# EAGLE board stm32-2inch40-usb-sd-proto (EAGLE 6.6.0), part 1 of 2
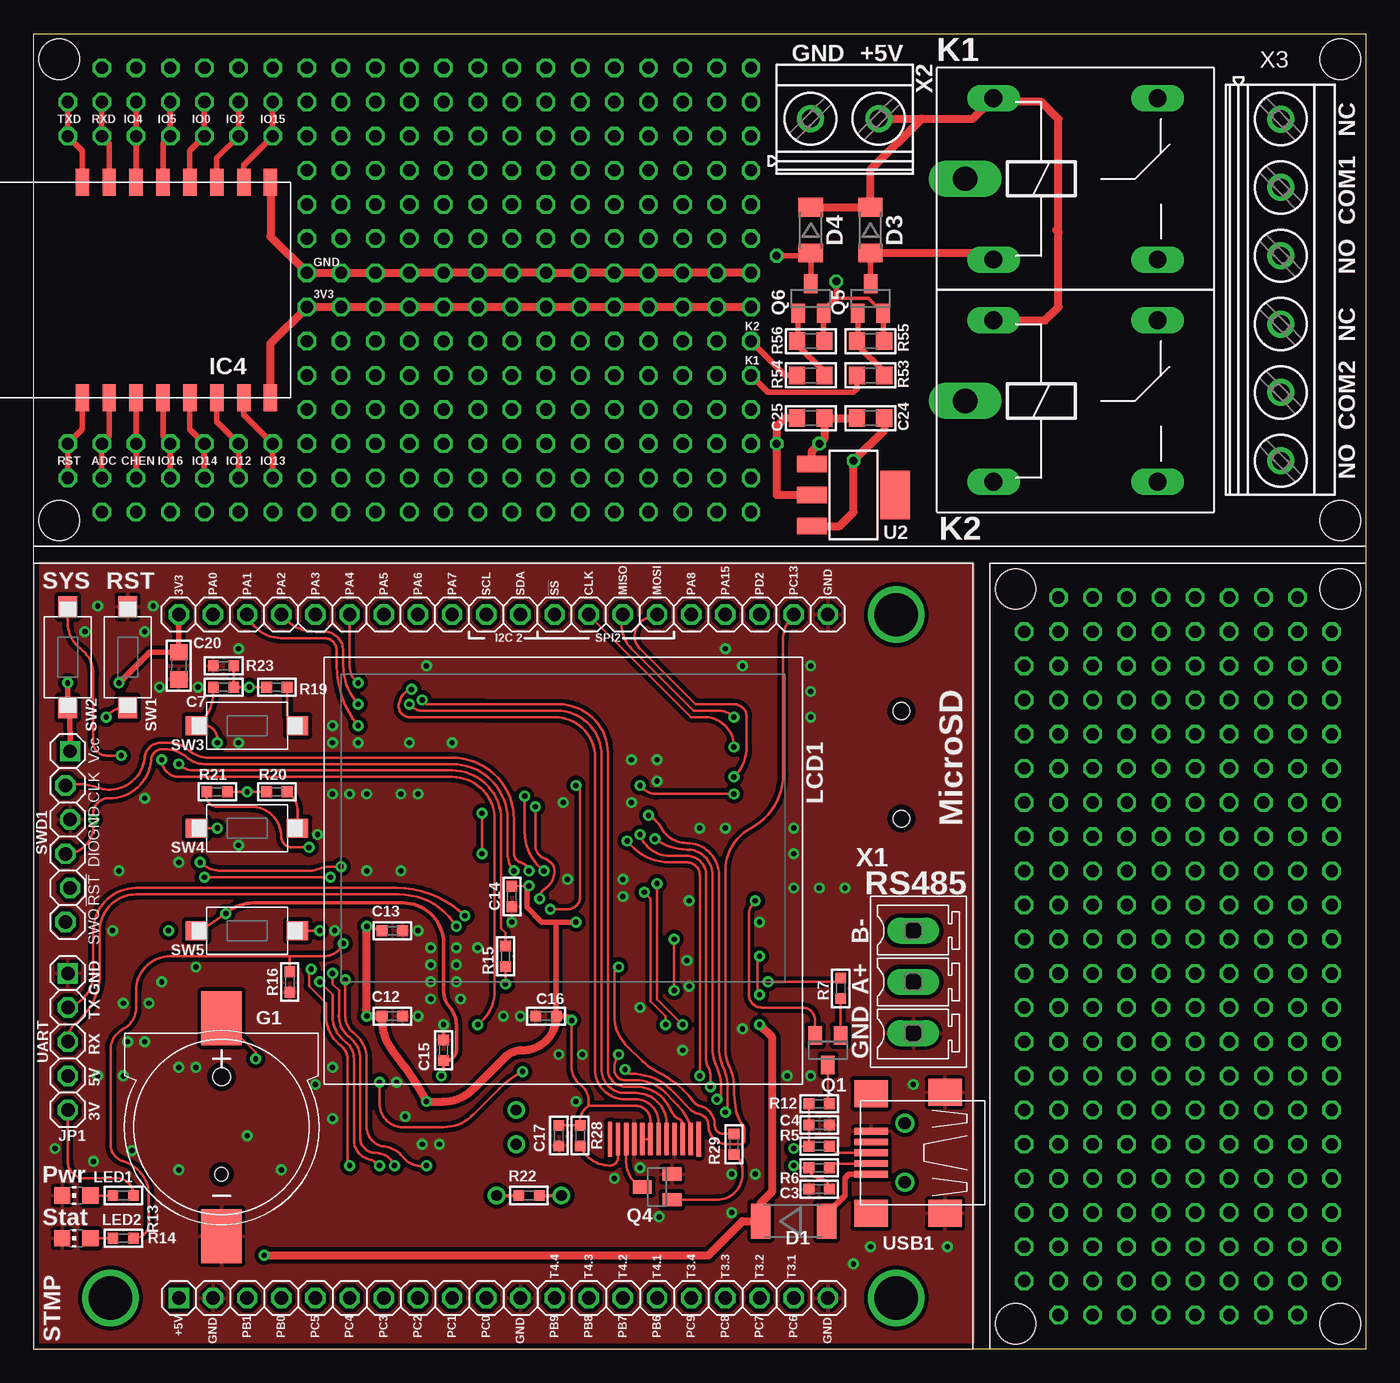
[diagram p3: board, top side]
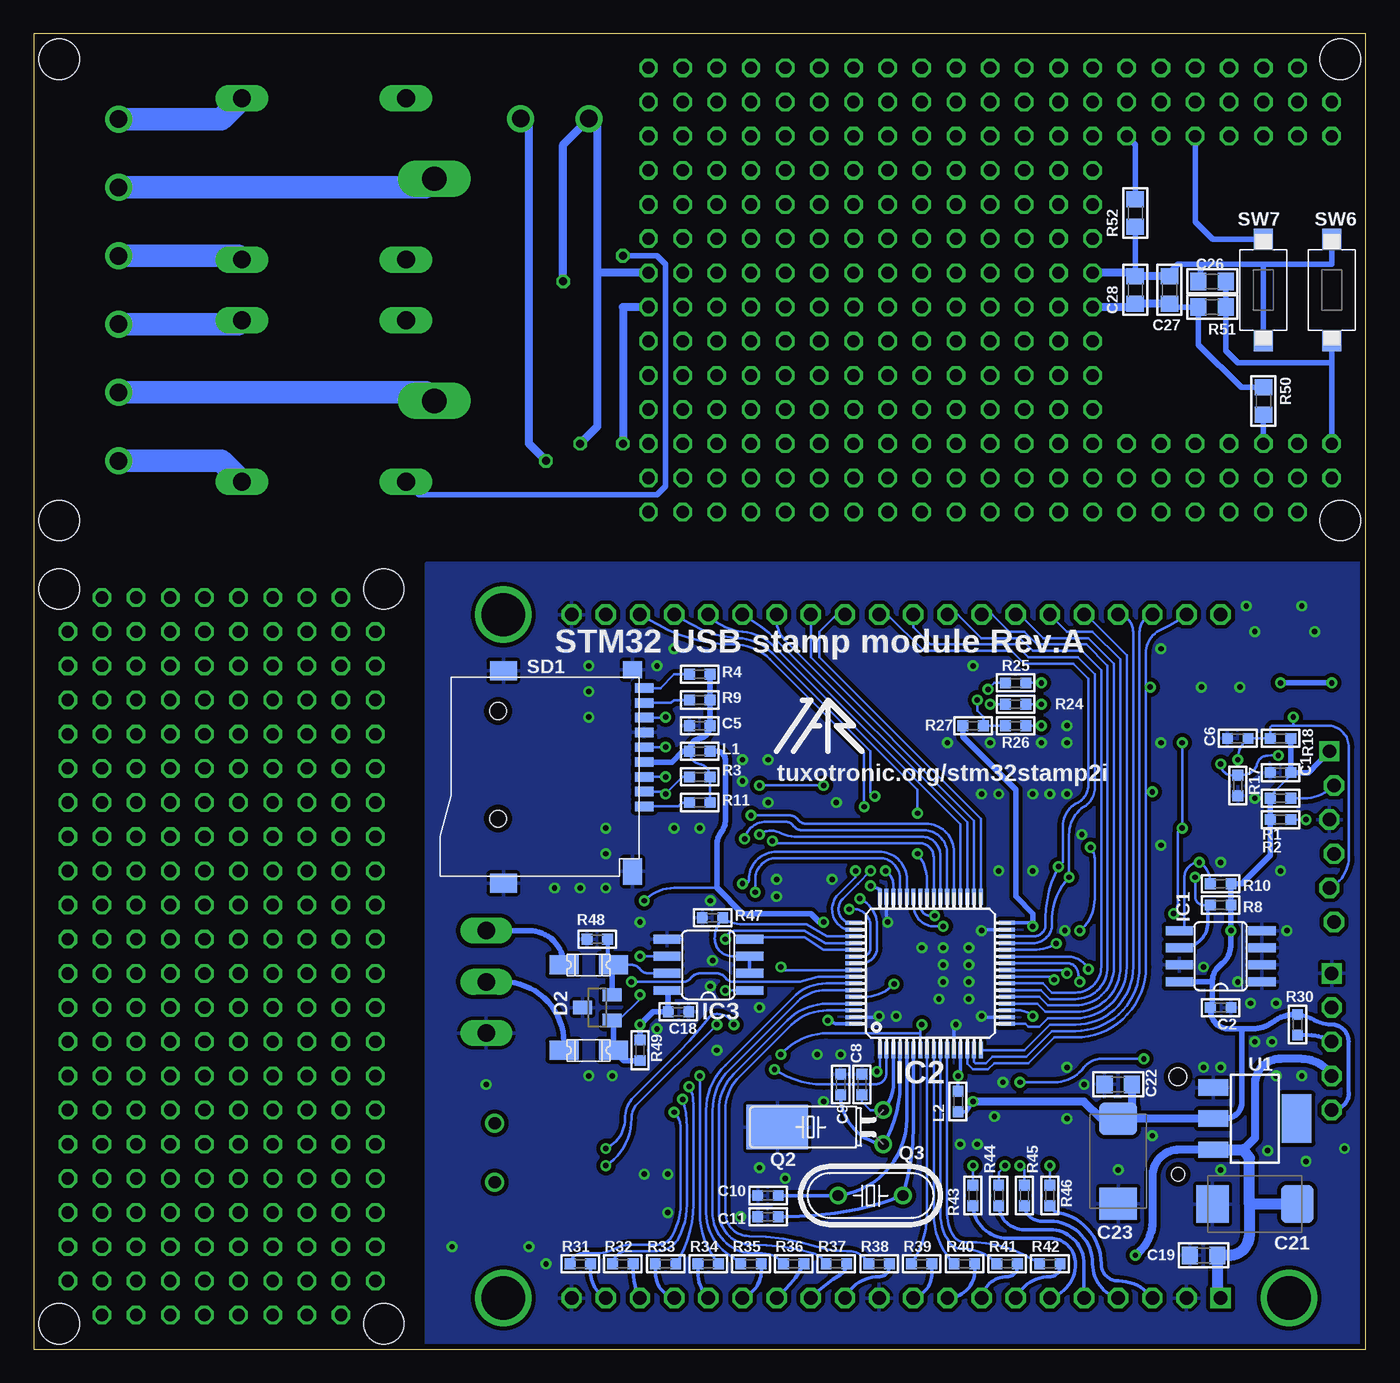
[diagram p4: board, bottom side, seen from below]

Size 99.06 x 97.79 mm. Coordinates in mm from the lower left corner, seen from the top.
Outline: 99.06,0 0,0 0,97.79 99.06,97.79 99.06,0
Copper layers (1*16): Top 0.035mm / dielectric 1.5mm / Bottom 0.035mm
Design rules "default *": minimum track width 0.16mm, minimum drill 0.4mm, track to track 0.16mm, track to pad 0.16mm, pad to pad 0.16mm, via to via 0.16mm, smd to smd 0.16mm, copper to edge 0.4mm, drill to drill 8mil, minimum pad ring 10mil, minimum via ring 8mil, stop-mask expansion 4mil, vias tented up to drill 0.6mm, thermal gap 10mil
Holes 3 mm at 73.03,1.91 97.16,1.91 73.03,56.52 97.16,56.52 97.16,61.59 97.16,95.89 1.91,95.89 1.91,61.59

## Footprints (pad centres in the part's own frame; a part is rotated, then mirrored left to right if it is on the bottom)
C0603 = smd 0.8 x 0.8: 1 -0.762,0; 2 0.762,0
C0805 = smd 1.2 x 1.3: 1 -1.016,0; 2 1.016,0
SMC_D = smd 2.4 x 2.8: + -3.15,0; - 3.15,0
SOD87 = smd 1.45 x 2.6: 1 -2.445,0; 2 2.445,0
SOT23 = smd 1 x 1.4: 1 -0.95,-1.1; 2 0.95,-1.1; 3 0,1.1
SOD80 = smd 1.4 x 1.8: 1 -1.7,0; 2 1.7,0
1206L = smd 2.16 x 1.4: P$1 -1.85,0; P$2 1.85,0
SMT1220 = smd 4 x 3: + -8.1,0; - 8.1,0 | hole 1: 3.5,0 | hole 1.3: -3.75,0
SO08 = smd 0.66 x 2.032: 1 -1.905,-3.073; 2 -0.635,-3.073; 3 0.635,-3.073; 4 1.905,-3.073; 5 1.905,3.073; 6 0.635,3.073; 7 -0.635,3.073; 8 -1.905,3.073
TQFP64 = smd 1.2 x 0.3: 1 -5.7,3.75; 2 -5.7,3.25; 3 -5.7,2.75; 4 -5.7,2.25; 5 -5.7,1.75; 6 -5.7,1.25; 7 -5.7,0.75; 8 -5.7,0.25; 9 -5.7,-0.25; 10 -5.7,-0.75; 11 -5.7,-1.25; 12 -5.7,-1.75; 13 -5.7,-2.25; 14 -5.7,-2.75; 15 -5.7,-3.25; 16 -5.7,-3.75; 33 5.7,-3.75; 34 5.7,-3.25; 35 5.7,-2.75; 36 5.7,-2.25; 37 5.7,-1.75; 38 5.7,-1.25; 39 5.7,-0.75; 40 5.7,-0.25; 41 5.7,0.25; 42 5.7,0.75; 43 5.7,1.25; 44 5.7,1.75; 45 5.7,2.25; 46 5.7,2.75; 47 5.7,3.25; 48 5.7,3.75 | smd 0.3 x 1.2: 17 -3.75,-5.7; 18 -3.25,-5.7; 19 -2.75,-5.7; 20 -2.25,-5.7; 21 -1.75,-5.7; 22 -1.25,-5.7; 23 -0.75,-5.7; 24 -0.25,-5.7; 25 0.25,-5.7; 26 0.75,-5.7; 27 1.25,-5.7; 28 1.75,-5.7; 29 2.25,-5.7; 30 2.75,-5.7; 31 3.25,-5.7; 32 3.75,-5.7; 49 3.75,5.7; 50 3.25,5.7; 51 2.75,5.7; 52 2.25,5.7; 53 1.75,5.7; 54 1.25,5.7; 55 0.75,5.7; 56 0.25,5.7; 57 -0.25,5.7; 58 -0.75,5.7; 59 -1.25,5.7; 60 -1.75,5.7; 61 -2.25,5.7; 62 -2.75,5.7; 63 -3.25,5.7; 64 -3.75,5.7
ESP12 = smd 1 x 2: 1 -4,-8; 2 -2,-8; 3 0,-8; 4 2,-8; 5 4,-8; 6 6,-8; 7 8,-8; 8 10,-8; 9 10,8; 10 8,8; 11 6,8; 12 4,8; 13 2,8; 14 0,8; 15 -2,8; 16 -4,8
UART_1X05 = drill 1 square: 1 -5.08,0 | drill 1 octagon: 2 -2.54,0; 3 0,0; 4 2.54,0; 5 5.08,0
ZF112 = drill 1.321 long: 1 -6.096,5.994; 2 -6.096,-5.994; O 6.096,5.994; S 6.096,-5.994 | drill 1.803 long: P -8.204,0
L0603 = smd 0.8 x 0.8: 1 -0.762,0; 2 0.762,0
NOKIA1202LCD-EXT = smd 0.32 x 2.6: 0 -10.09,23.114; 11 -3.49,23.114 | smd 0.32 x 2.4: 1 -9.49,23.114; 2 -8.89,23.114; 3 -8.29,23.114; 4 -7.69,23.114; 5 -7.09,23.114; 6 -6.49,23.114; 7 -5.89,23.114; 8 -5.29,23.114; 9 -4.69,23.114; 10 -4.09,23.114
CHIP-LED0805 = smd 1.2 x 1.2: A 0,-1.05; C 0,1.05
TC38H-G = drill 0.8: 1 -1.27,0; 2 1.27,0 | smd 3.302 x 4.572: GND 0,7.874
HC49/S = drill 0.813: 1 -2.413,0; 2 2.413,0
R0603 = smd 0.8 x 0.8: 1 -0.762,0; 2 0.762,0
R0805 = smd 1.2 x 1.3: 1 -1.016,0; 2 1.016,0
TF-PULL = smd 0.7 x 1.4: 1 -2.2,-7.62; 2 -1.1,-7.62; 3 0,-7.62; 4 1.1,-7.62; 5 2.2,-7.62; 6 3.3,-7.62; 7 4.4,-7.62; 8 5.5,-7.62; 9 6.6,-7.62 | smd 1.4 x 2: S1 -7.9,2.85; S2 7.9,2.85 | smd 1.28 x 1.4: S3 7.96,-6.75 | smd 1.95 x 1.4: S4 -7.025,-6.75 | hole 1.25: -3.1,3.25; 4.9,3.25
STAMP-40 = drill 1 square: 1 -24.13,-25.4 | drill 1 octagon: 2 -21.59,-25.4; 3 -19.05,-25.4; 4 -16.51,-25.4; 5 -13.97,-25.4; 6 -11.43,-25.4; 7 -8.89,-25.4; 8 -6.35,-25.4; 9 -3.81,-25.4; 10 -1.27,-25.4; 11 1.27,-25.4; 12 3.81,-25.4; 13 6.35,-25.4; 14 8.89,-25.4; 15 11.43,-25.4; 16 13.97,-25.4; 17 16.51,-25.4; 18 19.05,-25.4; 19 21.59,-25.4; 20 24.13,-25.4; 21 24.13,25.4; 22 21.59,25.4; 23 19.05,25.4; 24 16.51,25.4; 25 13.97,25.4; 26 11.43,25.4; 27 8.89,25.4; 28 6.35,25.4; 29 3.81,25.4; 30 1.27,25.4; 31 -1.27,25.4; 32 -3.81,25.4; 33 -6.35,25.4; 34 -8.89,25.4; 35 -11.43,25.4; 36 -13.97,25.4; 37 -16.51,25.4; 38 -19.05,25.4; 39 -21.59,25.4; 40 -24.13,25.4
KSS-2EG4430 = smd 1.6 x 1.4: 1 -3.75,0; 2 3.75,0
JTAG6PIN = drill 1 square: 1 -6.35,0.178 | drill 1 octagon: 2 -3.81,-0.178; 3 -1.27,0.178; 4 1.27,-0.178; 5 3.81,0.178; 6 6.35,-0.178
SOT223 = smd 1.219 x 2.235: 1 -2.311,-3.099; 2 0,-3.099; 3 2.311,-3.099 | smd 3.6 x 2.2: 4 0,3.099
USB-MB-S = smd 2.5 x 0.5: D+ 2.5,0; D- 2.5,0.8; GND 2.5,-1.6; ID 2.5,-0.8; VBUS 2.5,1.6 | smd 2.5 x 2: GND@1 -3,4.5; GND@2 2.5,4.5; GND@3 -3,-4.5; GND@4 2.5,-4.4 | drill 0.9: P$5 0,2.2; P$6 0,-2.2
MCV3 = drill 1.3 pad 1.905 long: 1 -3.81,0; 2 0,0; 3 3.81,0
MKDSN1,5/2-5,08 = drill 1.3 pad 2: 1 -2.561,0.025; 2 2.519,0.025
MKDSN1,5/6-5,08 = drill 1.3 pad 2: 1 -12.7,0.025; 2 -7.62,0.025; 3 -2.54,0.025; 4 2.54,0.025; 5 7.62,0.025; 6 12.7,0.025

## Placement (x,y rotation side)
C1  0.1  [C0603]  6.35,42.86 180 bottom
C2  0.1  [C0603]  10.79,25.4 0 bottom
C3  47pF  [C0603]  58.42,11.91 180 top
C4  47pF  [C0603]  58.42,16.67 0 top
C5  0.1  [C0603]  49.53,46.35 180 bottom
C6  0.1  [C0603]  9.53,45.4 180 bottom
C7  0.1  [C0603]  14.13,49.21 0 top
C8  10pF  [C0603]  37.47,19.68 90 bottom
C9  10pF  [C0603]  39.05,19.68 90 bottom
C10  22pF  [C0603]  44.45,11.43 180 bottom
C11  22pF  [C0603]  44.45,9.84 180 bottom
C12  0.1  [C0603]  26.67,24.77 0 top
C13  0.1  [C0603]  26.67,31.11 0 top
C14  0.1  [C0603]  35.56,33.66 270 top
C15  0.1  [C0603]  30.48,22.23 90 top
C16  0.1  [C0603]  38.1,24.77 180 top
C17  0.1  [C0603]  39.05,15.88 270 top
C18  0.1  [C0603]  51.12,25.08 0 bottom
C19  0.1  [C0805]  12.06,6.99 180 bottom
C20  0.1  [C0805]  10.79,50.8 270 top
C21  100uF/6V3  [SMC_D]  8.26,10.79 180 bottom
C22  0.1  [C0805]  18.41,19.68 180 bottom
C23  100uF/6V3  [SMC_D]  18.41,13.97 270 bottom
C24  10uF  [C0805]  62.23,69.22 180 top
C25  10uF  [C0805]  57.78,69.22 0 top
C26  0.1  [C0805]  11.43,79.38 180 bottom
C27  0.1  [C0805]  14.61,78.74 90 bottom
C28  10uF  [C0805]  17.14,78.74 90 bottom
D1  [SOD87]  56.52,9.53 0 top
D2  PESD1CAN  [SOT23]  57.15,25.4 90 bottom
D3  [SOD80]  62.23,83.19 270 top
D4  [SOD80]  57.78,83.19 270 top
F1  0.2A  [1206L]  57.78,28.57 180 bottom
F2  0.2A  [1206L]  57.78,22.23 180 bottom
G1  3V  [SMT1220]  13.97,16.51 270 top
IC1  CAT24M01WI-GT3  [SO08]  10.79,29.21 90 bottom
IC2  STM32F103RBT6  [TQFP64]  32.38,27.94 90 bottom
IC3  MAX487-S  [SO08]  48.9,28.57 90 bottom
IC4  [ESP12]  7.62,78.74 0 top
JP1  UART  [UART_1X05]  2.54,22.86 270 top
K1  ZF112  [ZF112]  77.47,87 0 top
K2  ZF112  [ZF112]  77.47,70.48 0 top
L1  FB_0603  [L0603]  49.53,44.45 180 bottom
L2  bead  [L0603]  30.32,18.41 90 bottom
LCD1  STE2007 (Nokia1202)  [NOKIA1202LCD-EXT]  39.37,38.73 180 top
LED1  Green  [CHIP-LED0805]  3.17,11.43 90 top
LED2  Red  [CHIP-LED0805]  3.17,8.26 90 top
LOGO1  LOGO  [TT_LOGO]  40.01,46.99 0 bottom
Q1  [SOT23]  59.05,22.23 180 top
Q2  32768Hz  [TC38H-G]  35.88,16.51 90 bottom
Q3  8MHz  [HC49/S]  36.83,11.43 0 bottom
Q4  MMBT2222  [SOT23]  46.35,12.06 90 top
Q5  MMBT2222  [SOT23]  62.23,78.11 0 top
Q6  MMBT2222  [SOT23]  57.78,78.11 0 top
R1  10K  [R0603]  6.35,40.96 180 bottom
R2  10K  [R0603]  6.35,39.37 180 bottom
R3  10K  [R0603]  49.53,42.55 0 bottom
R4  10K  [R0603]  49.53,50.16 0 bottom
R5  22  [R0603]  58.42,15.08 180 top
R6  22  [R0603]  58.42,13.49 180 top
R7  10K  [R0603]  60.01,26.83 270 top
R8  4.7K  [R0603]  10.79,33.02 0 bottom
R9  10K  [R0603]  49.53,48.26 0 bottom
R10  4.7K  [R0603]  10.79,34.61 0 bottom
R11  10K  [R0603]  49.53,40.64 0 bottom
R12  1.5K  [R0603]  58.42,18.26 0 top
R13  220  [R0603]  6.67,11.43 180 top
R14  220  [R0603]  6.67,8.26 180 top
R15  10K  [R0603]  35.08,29.21 90 top
R16  10K  [R0603]  19.05,27.3 270 top
R17  2.2K  [R0603]  9.53,41.91 90 bottom
R18  10K  [R0603]  6.35,45.4 0 bottom
R19  1K  [R0603]  18.1,49.21 180 top
R20  2K  [R0603]  18.1,41.43 180 top
R21  3.9K  [R0603]  13.65,41.43 0 top
R22  1M  [R0603]  36.83,11.43 0 top
R23  2K  [R0603]  14.13,50.8 0 top
R24  200  [R0603]  26.04,47.94 180 bottom
R25  200  [R0603]  26.04,49.53 180 bottom
R26  200  [R0603]  26.04,46.35 180 bottom
R27  4.7K  [R0603]  29.21,46.35 180 bottom
R28  10  [R0603]  40.64,15.88 90 top
R29  2K  [R0603]  52.07,15.24 90 top
R30  10K  [R0603]  5.08,24.13 90 bottom
R31  10  [R0603]  58.42,6.35 180 bottom
R32  10  [R0603]  55.24,6.35 180 bottom
R33  10  [R0603]  52.07,6.35 0 bottom
R34  10  [R0603]  48.9,6.35 0 bottom
R35  10  [R0603]  45.72,6.35 180 bottom
R36  10  [R0603]  42.55,6.35 180 bottom
R37  10  [R0603]  39.37,6.35 180 bottom
R38  10  [R0603]  36.2,6.35 180 bottom
R39  10  [R0603]  33.02,6.35 180 bottom
R40  10  [R0603]  29.84,6.35 180 bottom
R41  10  [R0603]  26.67,6.35 180 bottom
R42  10  [R0603]  23.5,6.35 180 bottom
R43  10  [R0603]  29.21,11.43 90 bottom
R44  10  [R0603]  27.3,11.43 90 bottom
R45  10  [R0603]  25.4,11.43 90 bottom
R46  10  [R0603]  23.5,11.43 90 bottom
R47  10K  [R0603]  48.58,32.07 0 bottom
R48  560  [R0603]  57.15,30.48 0 bottom
R49  560  [R0603]  53.98,22.23 90 bottom
R50  10  [R0805]  7.62,70.48 270 bottom
R51  10K  [R0805]  11.43,77.47 180 bottom
R52  10K  [R0805]  17.14,84.45 90 bottom
R53  1K  [R0805]  62.23,72.39 0 top
R54  1K  [R0805]  57.78,72.39 0 top
R55  10K  [R0805]  62.23,74.93 180 top
R56  10K  [R0805]  57.78,74.93 180 top
SD1  TF-HOLDER  [TF-PULL]  61.28,42.55 90 bottom
STMP  STAMP-40  [STAMP-40]  34.92,29.21 0 top
SW1  KSS-2EG4430  [KSS-2EG4430]  6.99,51.44 270 top
SW2  KSS-2EG4430  [KSS-2EG4430]  2.54,51.44 270 top
SW3  KSS-2EG4430  [KSS-2EG4430]  15.88,46.35 0 top
SW4  KSS-2EG4430  [KSS-2EG4430]  15.88,38.73 0 top
SW5  KSS-2EG4430  [KSS-2EG4430]  15.88,31.11 0 top
SW6  KSS-2EG4430  [KSS-2EG4430]  2.54,78.74 270 bottom
SW7  KSS-2EG4430  [KSS-2EG4430]  7.62,78.74 90 bottom
SWD1  SWD-6  [JTAG6PIN]  2.54,38.1 270 top
U1  L1117-3.3  [SOT223]  8.26,17.14 270 bottom
U2  L1117-3.3  [SOT223]  60.96,63.5 270 top
USB1  USB-MB-S  [USB-MB-S]  64.77,14.61 180 top
X1  MCV3  [MCV3]  65.41,27.3 270 top
X2  MKDSN1,5/2-5,08  [MKDSN1,5/2-5,08]  60.33,91.44 0 top
X3  MKDSN1,5/6-5,08  [MKDSN1,5/6-5,08]  92.71,78.74 270 top